# Altium schematic sheet LPCB224 - TEENSY.SchDoc
size A3; Address1: Factory 10; Address2: 9-13 Dingley Avenue, Dandeong, VICTORIA 3175, AUSTRALIA; DocumentNumber: 7; Revision: 1; SheetNumber: 7; SheetTotal: 7; Lockie__PCB_SUB_ASSEMBLY: Teensy Interface; Lockie__PCB_ASSEMBLY: Core Node; Lockie__LDL: LPCB224; Lockie__PCB_DESCRIPTION: Core Node
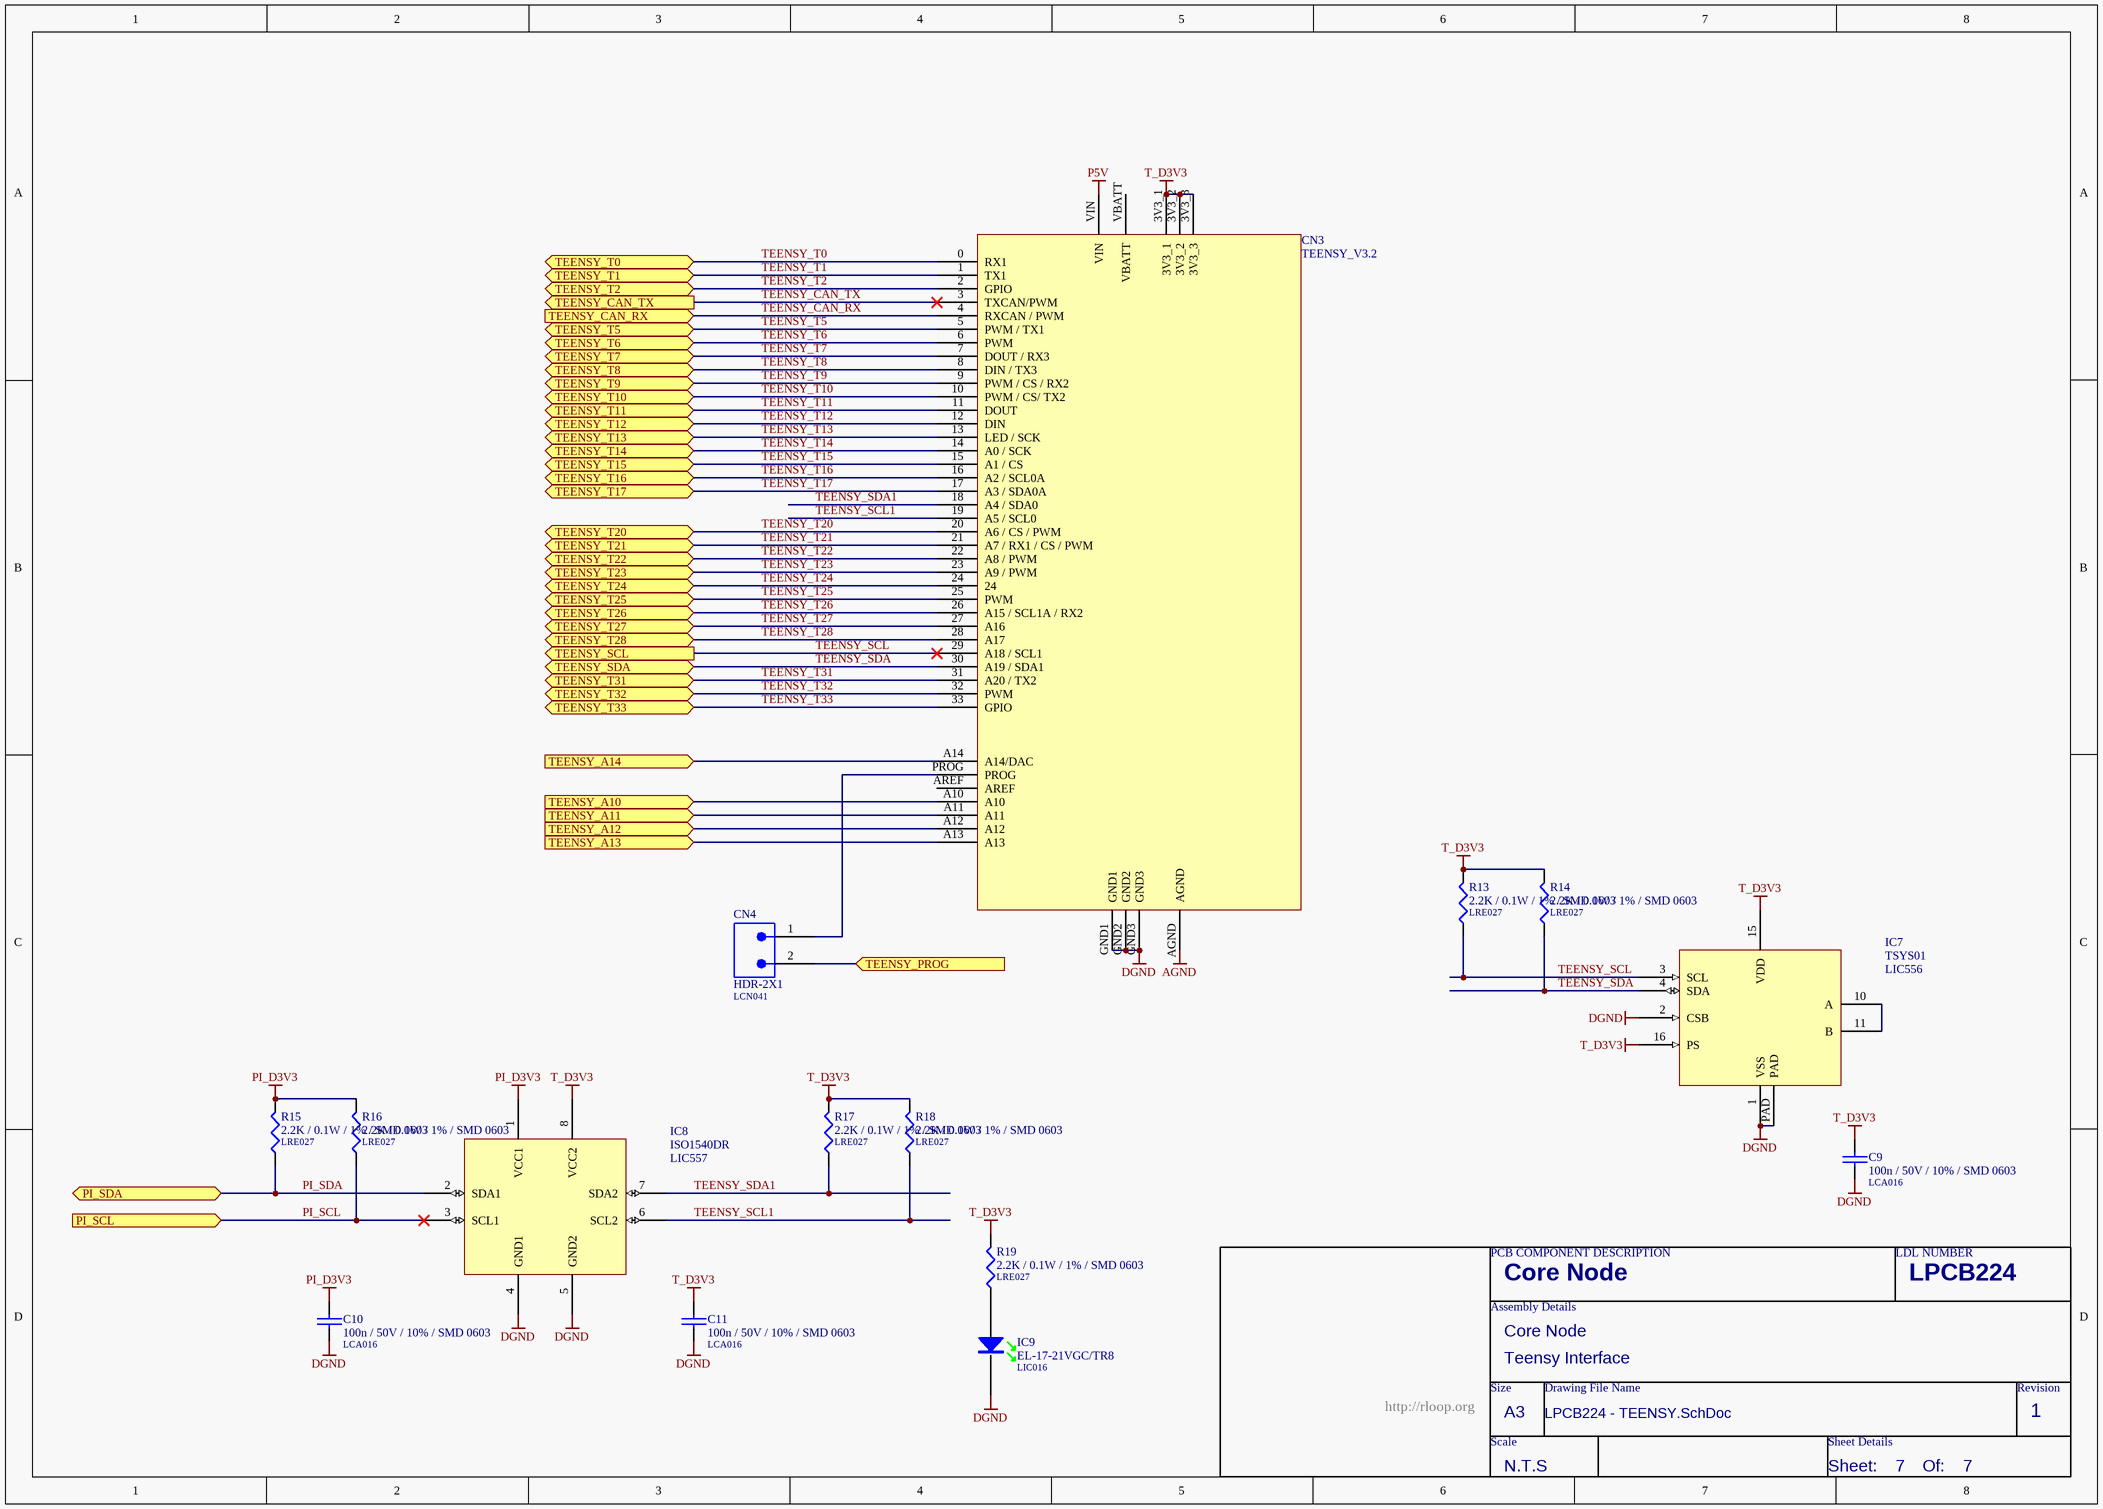
[diagram p0: LPCB224 - TEENSY.SchDoc]

## Parts
C9  100n / 50V / 10% / SMD 0603  LDL_NUMBER: LCA016  [LFP011__CC1608-0603-IPC7351_B]
C10  100n / 50V / 10% / SMD 0603  LDL_NUMBER: LCA016  [LFP011__CC1608-0603-IPC7351_B]
C11  100n / 50V / 10% / SMD 0603  LDL_NUMBER: LCA016  [LFP011__CC1608-0603-IPC7351_B]
CN3  TEENSY_V3.2  [TEENSY_V3.2]  (no BOM)
CN4  HDR-2X1  LDL_NUMBER: LCN041  [HDR-2X1]
IC7  TSYS01  LDL_NUMBER: LIC556  [LFP135__QFN65P400X400X80_HS-17M]
IC8  ISO1540DR  LDL_NUMBER: LIC557  [LFP097__SOIC150-8]
IC9  EL-17-21VGC/TR8  LDL_NUMBER: LIC016  [CR2012-0805-LED]
R13  2.2K / 0.1W / 1% / SMD 0603  LDL_NUMBER: LRE027  [LFP020__CR1608-0603-IPC7351_B]
R14  2.2K / 0.1W / 1% / SMD 0603  LDL_NUMBER: LRE027  [LFP020__CR1608-0603-IPC7351_B]
R15  2.2K / 0.1W / 1% / SMD 0603  LDL_NUMBER: LRE027  [LFP020__CR1608-0603-IPC7351_B]
R16  2.2K / 0.1W / 1% / SMD 0603  LDL_NUMBER: LRE027  [LFP020__CR1608-0603-IPC7351_B]
R17  2.2K / 0.1W / 1% / SMD 0603  LDL_NUMBER: LRE027  [LFP020__CR1608-0603-IPC7351_B]
R18  2.2K / 0.1W / 1% / SMD 0603  LDL_NUMBER: LRE027  [LFP020__CR1608-0603-IPC7351_B]
R19  2.2K / 0.1W / 1% / SMD 0603  LDL_NUMBER: LRE027  [LFP020__CR1608-0603-IPC7351_B]

## Ports
PI_SCL (in), PI_SDA (bidir), TEENSY_A10 (in), TEENSY_A11 (in), TEENSY_A12 (in), TEENSY_A13 (in), TEENSY_A14 (in), TEENSY_CAN_RX (in), TEENSY_CAN_TX (out), TEENSY_PROG (in), TEENSY_SCL (out), TEENSY_SDA (bidir), TEENSY_T0 (bidir), TEENSY_T1 (bidir), TEENSY_T2 (bidir), TEENSY_T5 (bidir), TEENSY_T6 (bidir), TEENSY_T7 (bidir), TEENSY_T8 (bidir), TEENSY_T9 (bidir), TEENSY_T10 (bidir), TEENSY_T11 (bidir), TEENSY_T12 (bidir), TEENSY_T13 (bidir), TEENSY_T14 (bidir), TEENSY_T15 (bidir), TEENSY_T16 (bidir), TEENSY_T17 (bidir), TEENSY_T20 (bidir), TEENSY_T21 (bidir), TEENSY_T22 (bidir), TEENSY_T23 (bidir), TEENSY_T24 (bidir), TEENSY_T25 (bidir), TEENSY_T26 (bidir), TEENSY_T27 (bidir), TEENSY_T28 (bidir), TEENSY_T31 (bidir), TEENSY_T32 (bidir), TEENSY_T33 (bidir)

## Nets
AGND: CN3.AGND
DGND: C9.2 C10.2 C11.2 CN3.GND1 CN3.GND2 CN3.GND3 IC7.1(VSS) IC7.2(CSB) IC7.PAD IC8.4(GND1) IC8.5(GND2) IC9.K
P5V: CN3.VIN
PI_D3V3: C10.1 IC8.1(VCC1) R15.2 R16.2
T_D3V3: C9.1 C11.1 CN3.3V3_1 CN3.3V3_2 CN3.3V3_3 IC7.15(VDD) IC7.16(PS) IC8.8(VCC2) R13.2 R14.2 R17.2 R18.2 R19.2
PI_SCL: IC8.3(SCL1) R16.1 ; port PI_SCL
PI_SDA: IC8.2(SDA1) R15.1 ; port PI_SDA
TEENSY_A10: CN3.A10 ; port TEENSY_A10
TEENSY_A11: CN3.A11 ; port TEENSY_A11
TEENSY_A12: CN3.A12 ; port TEENSY_A12
TEENSY_A13: CN3.A13 ; port TEENSY_A13
TEENSY_A14: CN3.A14(A14/DAC) ; port TEENSY_A14
TEENSY_CAN_RX: CN3.4(RXCAN_/_PWM) ; port TEENSY_CAN_RX
TEENSY_CAN_TX: CN3.3(TXCAN/PWM) ; port TEENSY_CAN_TX
TEENSY_PROG: CN4.2 ; port TEENSY_PROG
TEENSY_SCL: CN3.29(A18_/_SCL1) IC7.3(SCL) R13.1 ; port TEENSY_SCL
TEENSY_SCL1: CN3.19(A5_/_SCL0) IC8.6(SCL2) R18.1
TEENSY_SDA: CN3.30(A19_/_SDA1) IC7.4(SDA) R14.1 ; port TEENSY_SDA
TEENSY_SDA1: CN3.18(A4_/_SDA0) IC8.7(SDA2) R17.1
TEENSY_T0: CN3.0(RX1) ; port TEENSY_T0
TEENSY_T1: CN3.1(TX1) ; port TEENSY_T1
TEENSY_T2: CN3.2(GPIO) ; port TEENSY_T2
TEENSY_T5: CN3.5(PWM_/_TX1) ; port TEENSY_T5
TEENSY_T6: CN3.6(PWM) ; port TEENSY_T6
TEENSY_T7: CN3.7(DOUT_/_RX3) ; port TEENSY_T7
TEENSY_T8: CN3.8(DIN_/_TX3) ; port TEENSY_T8
TEENSY_T9: CN3.9(PWM_/_CS_/_RX2) ; port TEENSY_T9
TEENSY_T10: CN3.10(PWM_/_CS/_TX2) ; port TEENSY_T10
TEENSY_T11: CN3.11(DOUT) ; port TEENSY_T11
TEENSY_T12: CN3.12(DIN) ; port TEENSY_T12
TEENSY_T13: CN3.13(LED_/_SCK) ; port TEENSY_T13
TEENSY_T14: CN3.14(A0_/_SCK) ; port TEENSY_T14
TEENSY_T15: CN3.15(A1_/_CS) ; port TEENSY_T15
TEENSY_T16: CN3.16(A2_/_SCL0A) ; port TEENSY_T16
TEENSY_T17: CN3.17(A3_/_SDA0A) ; port TEENSY_T17
TEENSY_T20: CN3.20(A6_/_CS_/_PWM) ; port TEENSY_T20
TEENSY_T21: CN3.21(A7_/_RX1_/_CS_/_PWM) ; port TEENSY_T21
TEENSY_T22: CN3.22(A8_/_PWM) ; port TEENSY_T22
TEENSY_T23: CN3.23(A9_/_PWM) ; port TEENSY_T23
TEENSY_T24: CN3.24 ; port TEENSY_T24
TEENSY_T25: CN3.25(PWM) ; port TEENSY_T25
TEENSY_T26: CN3.26(A15_/_SCL1A_/_RX2) ; port TEENSY_T26
TEENSY_T27: CN3.27(A16) ; port TEENSY_T27
TEENSY_T28: CN3.28(A17) ; port TEENSY_T28
TEENSY_T31: CN3.31(A20_/_TX2) ; port TEENSY_T31
TEENSY_T32: CN3.32(PWM) ; port TEENSY_T32
TEENSY_T33: CN3.33(GPIO) ; port TEENSY_T33
NetCN3_PROG: CN3.PROG CN4.1
NetIC7_10: IC7.10(A) IC7.11(B)
NetIC9_A: IC9.A R19.1

Not connected (* = marked no-connect by the designer): CN3 AREF VBATT

## Notes on the sheet
- PCB COMPONENT DESCRIPTION
- LDL NUMBER
- Assembly Details
- Size
- Drawing File Name
- Revision
- http://rloop.org
- Scale
- A3
- Sheet Details
- N.T.S
- Sheet:
- Of:

## Library data of the parts
C9-C11 = 100n / 50V / 10% / SMD 0603: Capacitor, Ceramic Chip, 100nF (0.1uF), 50V, 5%, SMD 0603 [LCA016]; FMEDA__OPERATING__VOLTAGE_MIN: 0; FMEDA__OPERATING__VOLTAGE_MAX: 3.3; FMEDA__OPERATING__TEMP_MIN: -20; FMEDA__OPERATING__TEMP_TYP: 27; FMEDA__OPERATING__TEMP_MAX: 50; FMEDA__CHANNEL: COM; Value: 100n; FMEDA__FUNCTION_IN_SYSTEM: *; FMEDA__OPERATING__VOLTAGE_TYP: 3.3
CN4 = HDR-2X1: Header, 2.54mm (0.1in), 2 Pins x 1 Row (40 Per Row In Strip); FMEDA__CHANNEL: COM; FMEDA__OPERATING__CURRENT_MAX: 0; FMEDA__OPERATING__TEMP_MAX: 50; FMEDA__OPERATING__TEMP_MIN: -20; FMEDA__OPERATING__TEMP_TYP: 27; FMEDA__OPERATING__VOLTAGE_MAX: 16; FMEDA__OPERATING__VOLTAGE_TYP: 12; FMEDA__OPERATING__CURRENT_MIN: 0; FMEDA__OPERATING__CURRENT_TYP: 0; FMEDA__OPERATING__VOLTAGE_MIN: 0; FMEDA__FUNCTION_IN_SYSTEM: *
IC7 = TSYS01: IC, Digital Temp Sensor, SMD QFN16 [LIC556]
IC8 = ISO1540DR: IC, Digital Isolator for I2C, SMD SOIC8
IC9 = EL-17-21VGC/TR8: LED, SMD, 0805 Green [LIC016]; FMEDA__OPERATING__TEMP_MAX: 50; FMEDA__OPERATING__TEMP_MIN: -20; FMEDA__OPERATING__TEMP_TYP: 27; FMEDA__CHANNEL: COM; FMEDA__FUNCTION_IN_SYSTEM: *
R13-R19 = 2.2K / 0.1W / 1% / SMD 0603: Resistor, Ceramic Chip, 2.2K, 0.1W, 1%, SMD 0603 [LRE027]; FMEDA__OPERATING__VOLTAGE_MIN: 0; FMEDA__OPERATING__TEMP_MIN: -20; FMEDA__OPERATING__TEMP_TYP: 27; FMEDA__OPERATING__TEMP_MAX: 50; FMEDA__CHANNEL: COM; VALUE: 2.2K; FMEDA__OPERATING__VOLTAGE_MAX: 0; FMEDA__OPERATING__POWER_MIN: 0; FMEDA__OPERATING__POWER_MAX: 0; FMEDA__FUNCTION_IN_SYSTEM: *; FMEDA__OPERATING__VOLTAGE_TYP: 0